# EAGLE design USB-JTAG-Programmer_v4.0 (EAGLE 9.4.0)
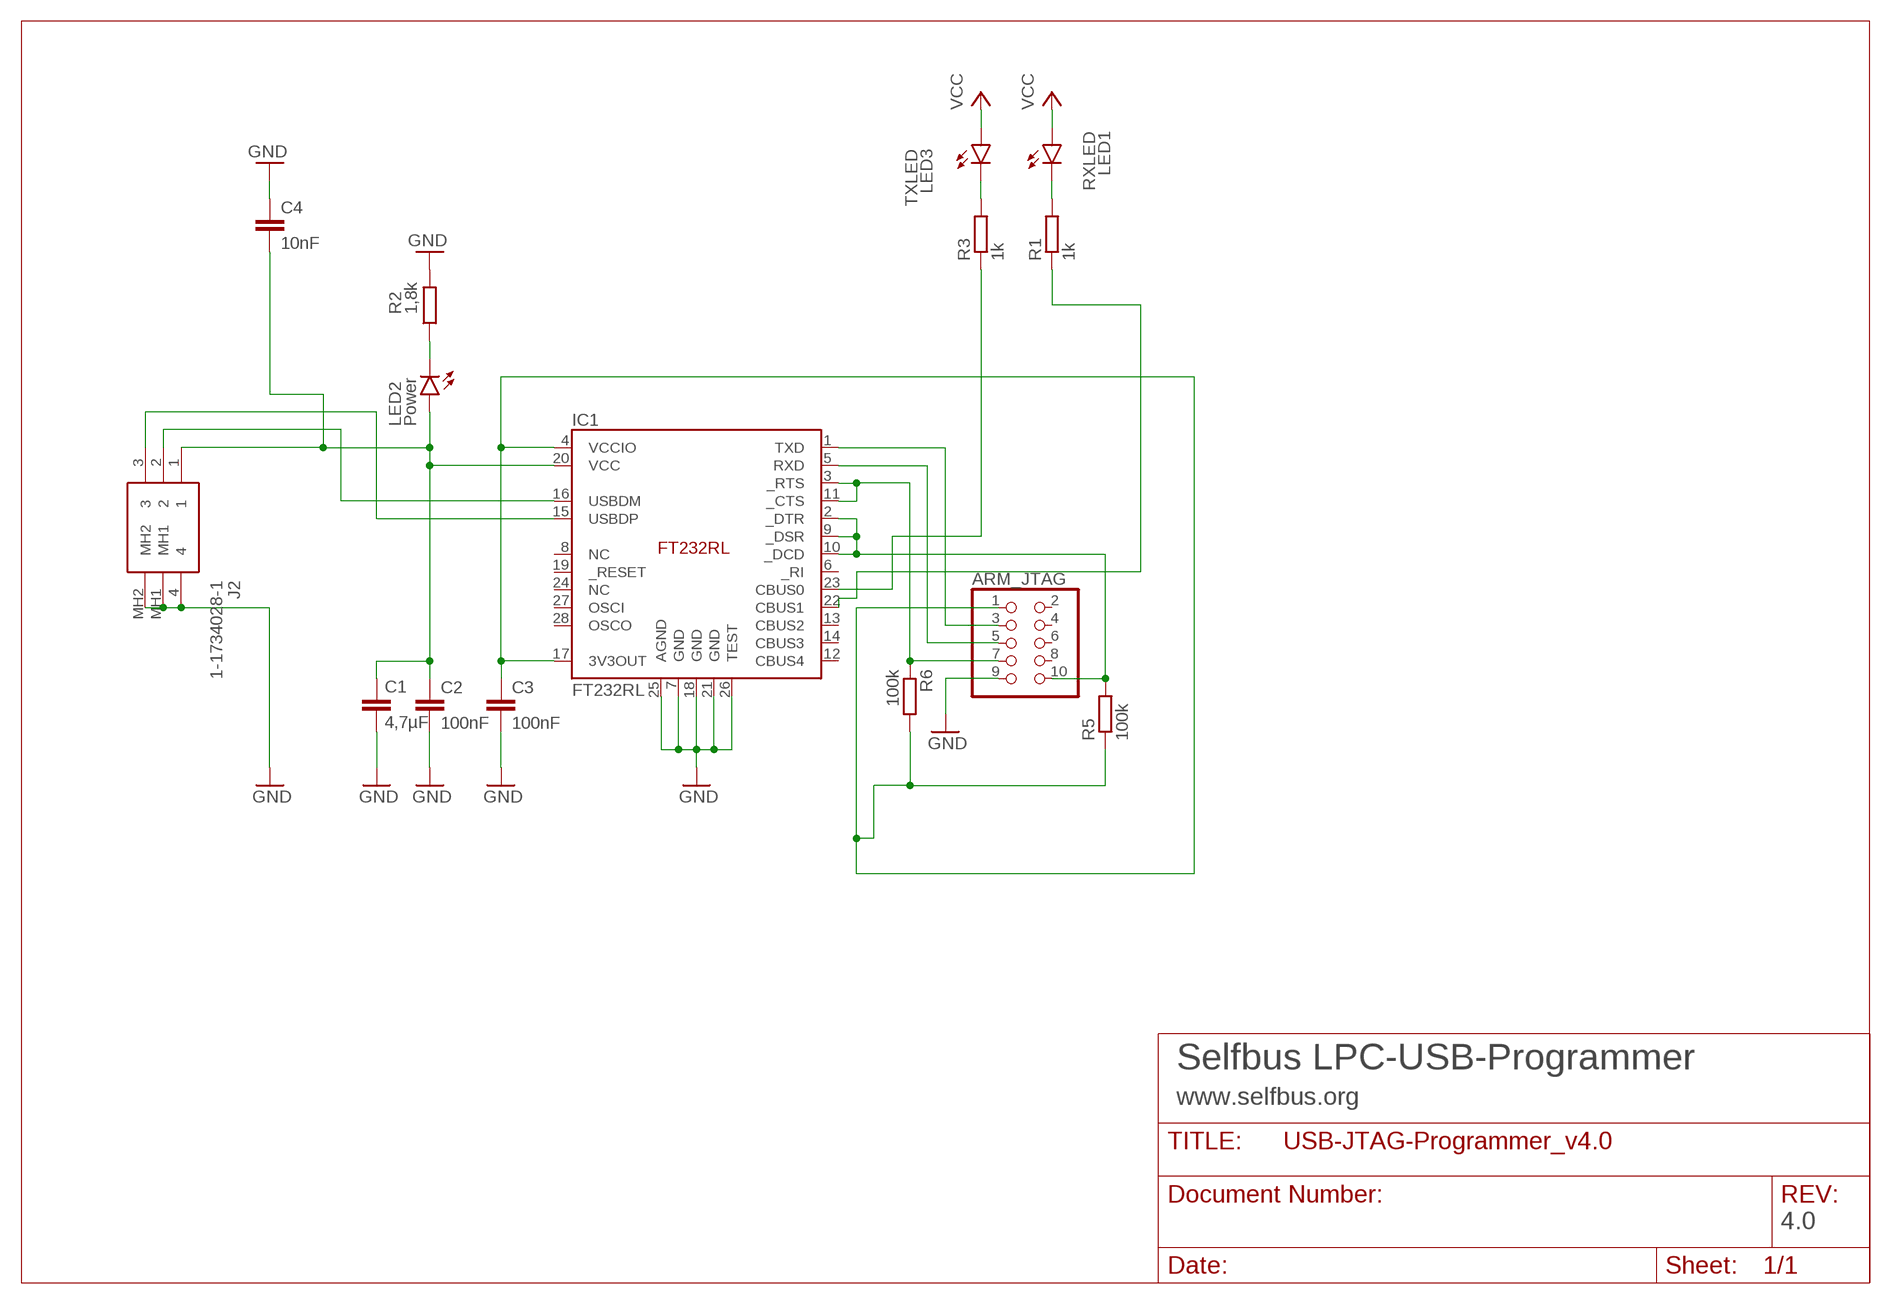
[diagram p0: schematic, sheet 1]

## Parts
ARM_JTAG  PINHD-2X5_2.00  [2X05M]
C1  4,7µF  C-EUC1206K  [C1206K]
C2  100nF  C-EUC0805K  [C0805K]
C3  100nF  C-EUC0805K  [C0805K]
C4  10nF  C-EUC0805K  [C0805K]
IC1  FT232RL  [SSOP-28]
J2  1-1734028-1  [117340281]
LED1  RXLED  LEDCHIPLED_0805  [CHIPLED_0805]
LED2  Power  LEDCHIPLED_0805  [CHIPLED_0805]
LED3  TXLED  LEDCHIPLED_0805  [CHIPLED_0805]
R1  1k  R-EU_R0805  [R0805]
R2  1,8k  R-EU_R0805  [R0805]
R3  1k  R-EU_R0805  [R0805]
R5  100k  R-EU_R0805  [R0805]
R6  100k  R-EU_R0805  [R0805]

## Nets
CBUS0: IC1.23(CBUS0) R3.1
GND: ARM_JTAG.9 C1.2 C2.2 C3.2 C4.1 IC1.7(GND) IC1.18(GND) IC1.21(GND) IC1.25(AGND) IC1.26(TEST) J2.4 J2.MH1 J2.MH2 R2.2
N$1: LED2.C R2.1
N$2: LED3.C R3.2
N$3: IC1.22(CBUS1) R1.1
N$4: LED1.C R1.2
PROG_PWR_ON: ARM_JTAG.10 IC1.2(_DTR) IC1.9(_DSR) IC1.10(_DCD) R5.2
RTS_CTS1: ARM_JTAG.7 IC1.3(_RTS) IC1.11(_CTS) R6.1
RXD: ARM_JTAG.5 IC1.5(RXD)
TXD: ARM_JTAG.3 IC1.1(TXD)
USBDM: IC1.16(USBDM) J2.2
USBDP: IC1.15(USBDP) J2.3
VCC: C1.1 C2.1 C4.2 IC1.20(VCC) J2.1 LED1.A LED2.A LED3.A
VCCIO: ARM_JTAG.1 C3.1 IC1.4(VCCIO) IC1.17(3V3OUT) R5.1 R6.2
Unconnected: ARM_JTAG.2 ARM_JTAG.4 ARM_JTAG.6 ARM_JTAG.8 IC1.6(_RI) IC1.8(NC) IC1.12(CBUS4) IC1.13(CBUS2) IC1.14(CBUS3) IC1.19(_RESET) IC1.24(NC) IC1.27(OSCI) IC1.28(OSCO)

## Notes on the sheet
- Selfbus LPC-USB-Programmer
- www.selfbus.org
- 4.0

## Library data of the parts
ARM_JTAG = pinhead-1:PINHD-2X5: PIN HEADER
C1-C4 = rcl:C-EU: CAPACITOR, European symbol; SPICEPREFIX: C
IC1 = ftdi4:FT232RL
J2 = SamacSys_Parts:1-1734028-1: USB Connectors Source: Datasheet <https://componentsearchengine.com/Datasheets/1/1-1734028-1.pdf>; DESCRIPTION: USB Connectors; HEIGHT: 4.7mm; MANUFACTURER_NAME: TE Connectivity; MANUFACTURER_PART_NUMBER: 1-1734028-1; MOUSER_PART_NUMBER: 571-1-1734028-1; MOUSER_PRICE-STOCK: https://www.mouser.com/Search/Refine.aspx?Keyword=571-1-1734028-1
LED1-LED3 = led:LED: LED OSRAM: - CHIPLED LG R971, LG N971, LY N971, LG Q971, LY Q971, LO R971, LY R971 LH N974, LH R974 LS Q976, LO Q976, LY Q976 LO Q996 - Hyper CHIPLED LW Q18S LB Q993, LB Q99A, LB R99A - SideLED LS A670, LO A670, LY A670, LG A670, LP A670 LB A673, LV A673, LT A673, LW A673 LH A674 LY A675 LS A676, LA A676, LO A676, LY A676, LW A676 LS A679, LY A679, LG A679 - Hyper Micro SIDELED® LS Y876, LA Y876, LO Y876, LY Y876 LT Y87S - SmartLED LW L88C, LW L88S LB L89C, LB L89S, LG L890 LS L89K, LO L89K, LY L89K LS L896, LA L896, LO L896, LY L896 - TOPLED LS T670, LO T670, LY T670, LG T670, LP T670 LSG T670, LSP T670, LSY T670, LOP T670, LYG T670 LG T671, LOG T671, LSG T671 LB T673, LV T673, LT T673, LW T673 LH T674 LS T676, LA T676, LO T676, LY T676, LB T676, LH T676, LSB T676, LW T676 LB T67C, LV T67C, LT T67C, LS T67K, LO T67K, LY T67K, LW E67C LS E67B, LA E67B, LO E67B, LY E67B, LB E67C, LV E67C, LT E67C LW T67C LS T679, LY T679, LG T679 LS T770, LO T770, LY T770, LG T770, LP T770 LB T773, LV T773, LT T773, LW T773 LH T774 LS E675, LA E675, LY E675, LS T675 LS T776, LA T776, LO T776, LY T776, LB T776 LHGB T686 LT T68C, LB T68C - Hyper Mini TOPLED® LB M676 - Mini TOPLED Santana® LG M470 LS M47K, LO M47K, LY M47K Source: http://www.osram.convergy.de LUXEON: - LUMILED® LXK2-PW12-R00, LXK2-PW12-S00, LXK2-PW14-U00, LXK2-PW14-V00 LXK2-PM12-R00, LXK2-PM12-S00, LXK2-PM14-U00 LXK2-PE12-Q00, LXK2-PE12-R00, LXK2-PE12-S00, LXK2-PE14-T00, LXK2-PE14-U00 LXK2-PB12-K00, LXK2-PB12-L00, LXK2-PB12-M00, LXK2-PB14-N00, LXK2-PB14-P00, LXK2-PB14-Q00 LXK2-PR12-L00, LXK2-PR12-M00, LXK2-PR14-Q00, LXK2-PR14-R00 LXK2-PD12-Q00, LXK2-PD12-R00, LXK2-PD12-S00 LXK2-PH12-R00, LXK2-PH12-S00 LXK2-PL12-P00, LXK2-PL12-Q00, LXK2-PL12-R00 Source: www.luxeon.com KINGBRIGHT: KA-3528ASYC Source: www.kingbright.com
R1 R3 R5 = resistor:R-EU_: RESISTOR, European symbol
R2 R6 = rcl:R-EU_: RESISTOR, European symbol; SPICEPREFIX: R

## Board
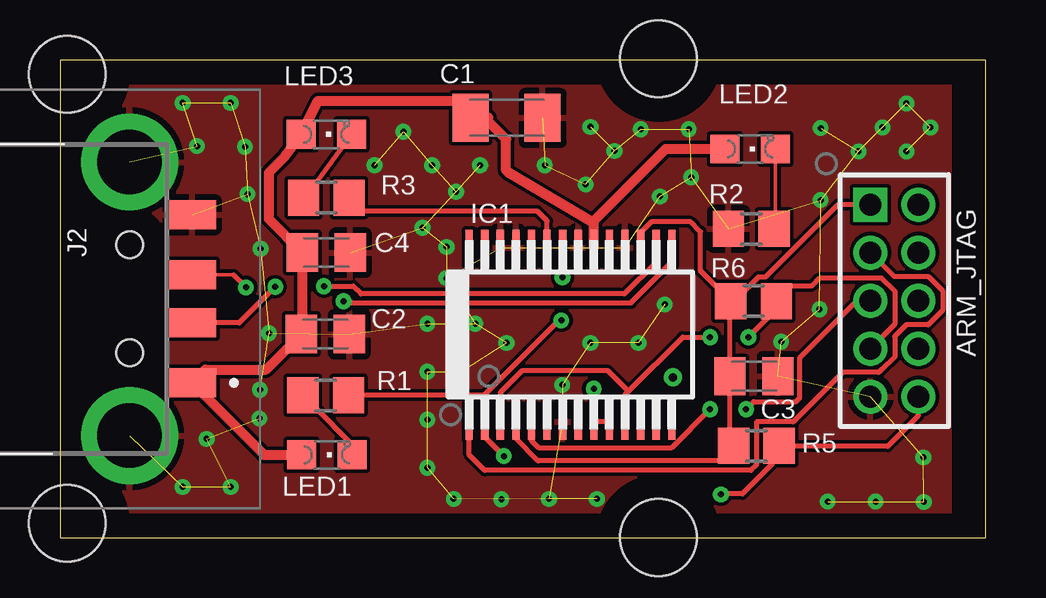
[diagram p1: board, top side]
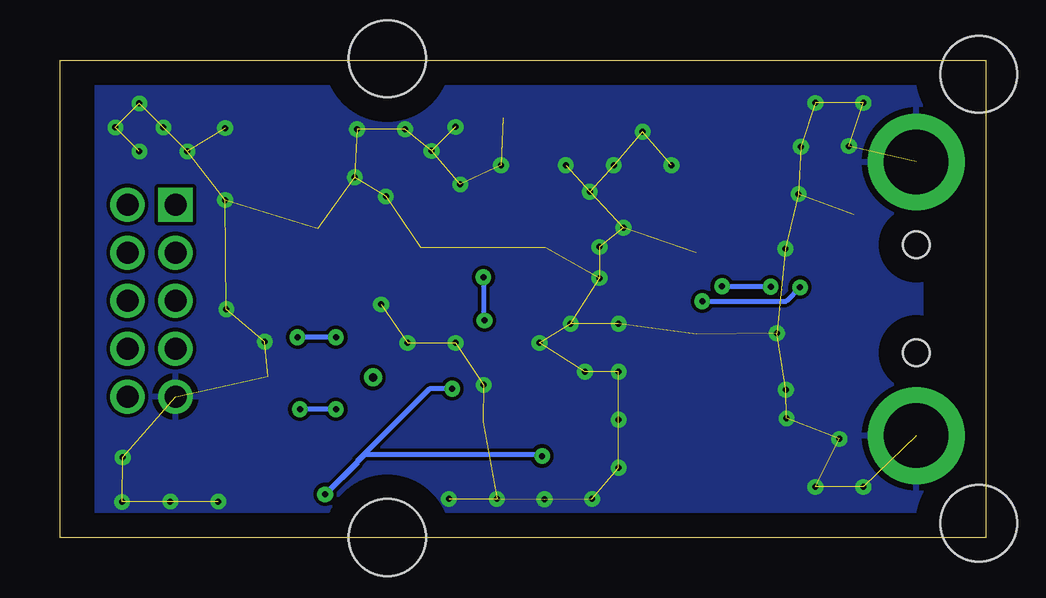
[diagram p2: board, bottom side, seen from below]

Size 38.6 x 19.9 mm. Coordinates in mm from the lower left corner, seen from the top.
Outline: 0,0 38.6,0 38.6,19.9 0,19.9 0,0
Copper layers (1*16): Top 0.035mm / dielectric 1.5mm / Bottom 0.035mm
Design rules "default": minimum track width 6mil, minimum drill 0.35mm, track to track 6mil, track to pad 6mil, pad to pad 6mil, via to via 6mil, smd to smd 6mil, copper to edge 40mil, drill to drill 6mil, minimum pad ring 10mil, minimum via ring 8mil, stop-mask expansion 4mil, vias tented up to drill 0mil, thermal gap 10mil
Holes 3.2 mm at 0.3,0.6 0.3,19.3 24.95,19.95 24.95,0

### Footprints (pad centres in the part's own frame; a part is rotated, then mirrored left to right if it is on the bottom)
2X05M = drill 0.914 square: 1 -4,-1 | drill 0.914: 2 -4,1; 3 -2,-1; 4 -2,1; 5 0,-1; 6 0,1; 7 2,-1; 8 2,1; 9 4,-1; 10 4,1
C1206K = smd 1.5 x 2: 1 -1.5,0; 2 1.5,0
C0805K = smd 1.3 x 1.6: 1 -1,0; 2 1,0
SSOP-28 = smd 0.3 x 1.5: 1 -4.225,-3.625; 2 -3.575,-3.625; 3 -2.925,-3.625; 4 -2.275,-3.625; 5 -1.625,-3.625; 6 -0.975,-3.625; 7 -0.325,-3.625; 8 0.325,-3.625; 9 0.975,-3.625; 10 1.625,-3.625; 11 2.275,-3.625; 12 2.925,-3.625; 13 3.575,-3.625; 14 4.225,-3.625; 15 4.225,3.625; 16 3.575,3.625; 17 2.925,3.625; 18 2.275,3.625; 19 1.625,3.625; 20 0.975,3.625; 21 0.325,3.625; 22 -0.325,3.625; 23 -0.975,3.625; 24 -1.625,3.625; 25 -2.275,3.625; 26 -2.925,3.625; 27 -3.575,3.625; 28 -4.225,3.625
117340281 = smd 1.2 x 2: 1 3.5,9.855; 2 1,9.855; 3 -1,9.855; 4 -3.5,9.855 | drill 2.69 pad 4.035: MH1 -5.7,7.255; MH2 5.7,7.255 | hole 1.1: -2.25,7.255; 2.25,7.255
CHIPLED_0805 = smd 1.2 x 1.2: A 0,-1.05; C 0,1.05
R0805 = smd 1.3 x 1.5: 1 -0.95,0; 2 0.95,0

### Placement (x,y rotation side)
ARM_JTAG  34.79,9.88 270 top
C1  18.62,17.49 0 top
C2  11.06,8.48 0 top
C3  28.93,6.72 0 top
C4  11.1,11.88 180 top
IC1  21.28,8.46 0 top
J2  -4.35,9.95 270 top
LED1  11.12,3.45 270 top
LED2  28.77,16.2 270 top
LED3  11.1,16.8 270 top
R1  11.07,5.92 180 top
R2  28.82,12.87 180 top
R3  11.1,14.17 180 top
R5  29.03,3.83 0 top
R6  28.91,9.85 180 top

### Tracks (layer width: path | path; a pad name or v marks a point on that pad's centre or on a via)
CBUS0
  Top 0.2: IC1.23 20.3,13.2 19.91,13.6 12.62,13.6 R3.1
GND  (via drill 0.25)  (69 unrouted)
  other vias: 34,1.5 36.01,1.49 35.99,3.34 16.41,1.61 15.31,4.91 7.11,2.11 5.11,2.11 26.31,15.01 35.29,16.09 35.29,18.09 33.29,16.09 23.11,16.11 7.71,16.29 7.11,18.11 5.11,18.11 18.61,8.11 16.11,12.11 8.36,12.04 6.11,4.11 31.71,14.06 22.11,8.11 24.11,8.11 31.71,17.06 34.29,17.09 36.29,17.09 24.21,17.01 22.11,17.11 14.31,16.91 31.66,9.51 32,1.5 8.71,8.51 20.94,6.36 30.06,8.16 8.34,6.16 8.31,4.96 16.71,6.91 15.31,6.91 7.81,14.31 15.51,15.51 13.11,15.51 17.51,15.51 21.91,14.71 15.31,8.91 17.31,8.91 25.21,9.71 16.11,10.81 15.11,12.91 20.21,15.51 18.4,1.6 20.39,1.61 22.39,1.61 16.51,14.41 26.21,17.01 25.01,14.21 15.31,2.91 5.71,16.31
  pour Bottom: 37.1,19.15 2.68,19.15 2.68,0.5 37.1,0.5
  pour Top: 2.68,19.15 37.1,19 37.1,0.5 2.68,0.5
N$1
  Top 0.152: LED2.C 29.82,12.91 R2.1
N$2
  Top 0.2: LED3.C 10.22,14.17 R3.2
N$3  (via drill 0.25)
  Top 0.2: v20.95,10.85 IC1.22 | v20.9,9.05 20.8,9.05 17.68,5.92 R1.1
  Bottom 0.2: v20.95,10.85 20.95,9.1 v20.9,9.05
N$4
  Top 0.2: R1.2 12.6,3.45 LED1.C
N$5  (via drill 0.35)
  other vias: 25.55,6.67
PROG_PWR_ON  (via drill 0.25)
  Top 0.152: IC1.9 22.25,5.49
  Top 0.2: ARM_JTAG.10 35.79,5.08 34.5,3.8 30.01,3.8 R5.2 29.69,3.53 29.69,3.05 28.45,1.82 27.57,1.82 v27.55,1.8 | 22.25,5.49 v22.25,6.2 | IC1.10 IC1.9 | IC1.2 17.71,4.2 v18.5,3.4
  Bottom 0.2: v22.25,6.2 23.2,6.2 26.18,3.23 26.18,3.15 27.53,1.8 v27.55,1.8 25.88,3.48 18.58,3.48 v18.5,3.4
RTS_CTS1  (via drill 0.25)
  Top 0.2: ARM_JTAG.7 34.79,8.88 34.79,10.28 34.25,10.82 31.69,10.82 31.36,10.5 30.51,10.5 R6.1 29.86,9.51 v28.7,8.35 | IC1.11 23.55,5.95 23.71,6.09 | 23.71,6.09 22.85,6.95 19.25,6.95 18.36,6.05 IC1.3 | 23.71,6.09 25.96,8.35 v27.1,8.35
  Bottom 0.2: v27.1,8.35 v28.7,8.35
RXD  (via drill 0.25)
  Top 0.2: IC1.5 19.66,4.04 19.95,3.75 25.5,3.75 v27.1,5.35 | ARM_JTAG.5 33.23,9.88 30.83,7.48 30.83,5.82 30.69,5.67 28.92,5.67 v28.6,5.35
  Bottom 0.2: v27.1,5.35 v28.6,5.35
TXD
  Top 0.2: ARM_JTAG.3 34.78,10.88 36.19,10.88 36.79,10.28 36.79,9.47 36.19,8.87 35.28,8.87 34.79,8.38 34.79,7.52 34.29,7.02 34.27,7.02 34.13,6.88 32.63,6.88 30.57,4.83 29.03,4.83 29.03,3.02 28.81,2.8 17.7,2.8 17.05,3.44 IC1.1
USBDM  (via drill 0.25)
  Top 0.152: J2.2
  Top 0.2: v8.97,10.45 7.47,8.95 J2.2 | IC1.16 24.86,11.48 23.53,10.15 12.55,10.15 12.22,10.47 v11,10.47
  Bottom 0.2: v11,10.47 9,10.47 v8.97,10.45
USBDP  (via drill 0.25)
  Top 0.152: 5.35,10.6 5.5,10.76 J2.3 7.22,10.95
  Top 0.2: v11.82,9.85 12.09,9.85 12.16,9.78 23.81,9.78 25.43,11.4 25.5,11.4 25.51,11.4 IC1.15 | v7.75,10.43 7.22,10.95
  Bottom 0.2: v11.82,9.85 8.32,9.85 v7.75,10.43
VCC
  Top 0.152: 16.7,18.2 17.4,17.5
  Top 0.406: LED1.A 8.5,3.45 J2.1 6.05,7 8.58,7 C2.1 10.1,8.52 C4.2 8.7,13.28 8.7,15.2 9.35,15.85 LED3.A 10.75,18.2 16.7,18.2 | IC1.20 22.26,13.1 | 22.26,13.1 22.26,13.2 25.25,16.2 LED2.A | 22.26,13.1 18.7,15.2 18.6,15.3 18.6,16.6 17.85,17.35 17.85,17.51 17.4,17.5 C1.1
VCCIO
  Top 0.2: ARM_JTAG.1 32.44,13.88 29.41,10.85 29.11,10.85 28.11,9.85 | 28.11,9.85 R6.2 26.7,11.11 26.7,12.75 26.3,13.15 24.65,13.15 24.21,12.71 IC1.17 | 28.11,9.85 27.93,9.68 C3.1 27.93,3.97 R5.1 27.46,3.2 19.93,3.2 19.01,4.13 IC1.4

### Text on the board
tDocu: + | - | + | - | + | -